# EAGLE design step_down (EAGLE 8.7.0)
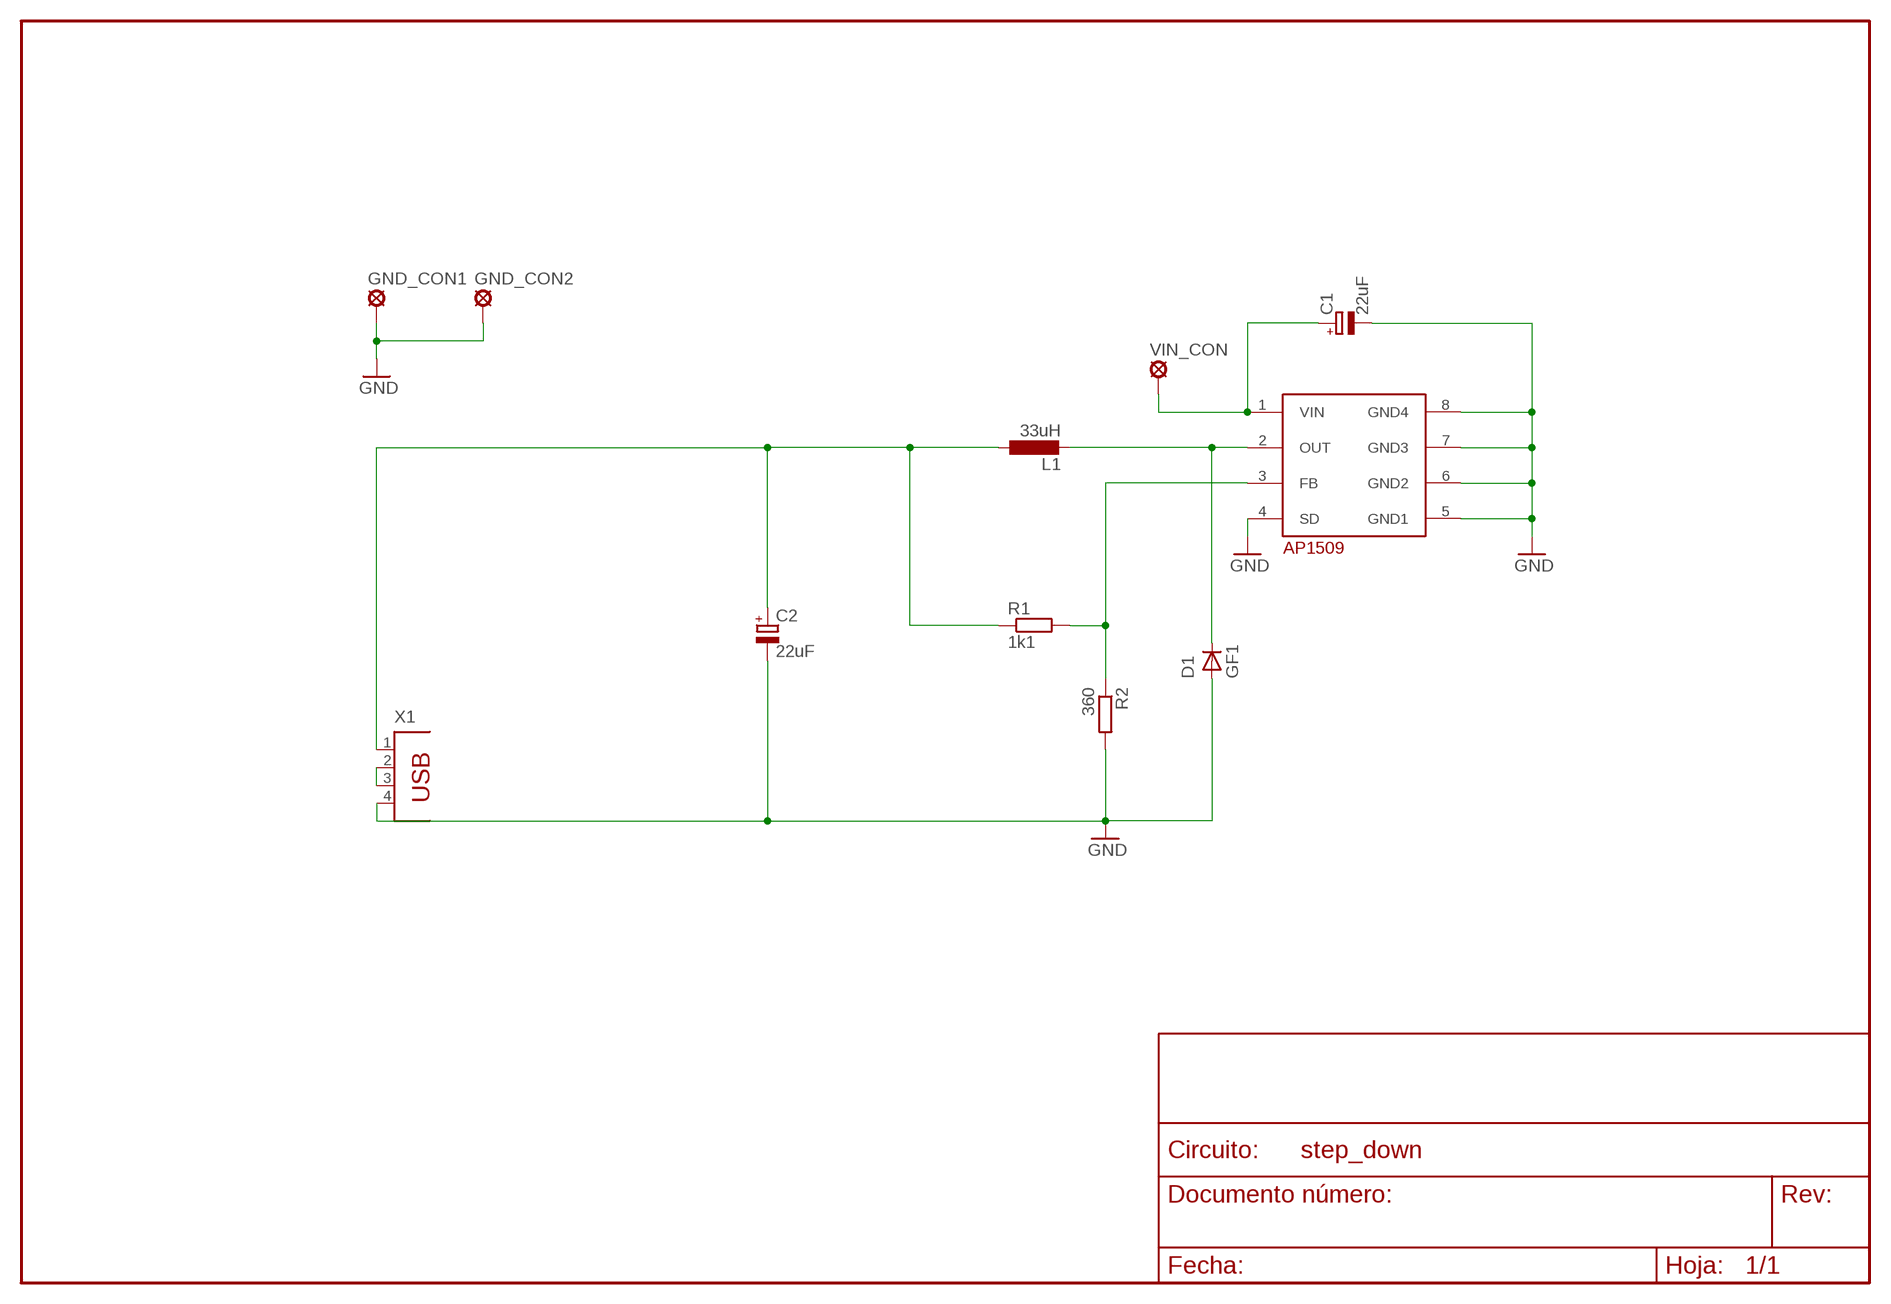
[diagram p0: schematic, sheet 1]

## Parts
C1  22uF  CPOL-EUCT7343  [CT7343]
C2  22uF  CPOL-EUCT3216  [CT3216]
D1  GF1  [SMA-DO214AC]
GND_CON1  SE14  [SE14]
GND_CON2  SE14  [SE14]
L1  33uH  SRN6045TAL  [L8051]
R1  1k1  R-EU_M3216  [M3216]
R2  360  R-EU_M3216  [M3216]
U1  AP1509S  [SOIC8]
VIN_CON  SE14  [SE14]
X1  PN87520  [PN87520]

## Nets
GND: C1.- C2.- D1.A GND_CON1.MP GND_CON2.MP R2.2 U1.4(SD) U1.5(GND1) U1.6(GND2) U1.7(GND3) U1.8(GND4) X1.4
N$1: C1.+ U1.1(VIN) VIN_CON.MP
N$2: X1.2 X1.3
N$3: D1.K(C) L1.2 U1.2(OUT)
N$4: C2.+ L1.1 R1.1 X1.1
N$5: R1.2 R2.1 U1.3(FB)

## Library data of the parts
C1 C2 = rcl:CPOL-EU: POLARIZED CAPACITOR, European symbol; SPICEPREFIX: C
D1 = diode:GF1: DIODE; SPICEPREFIX: D
GND_CON1 GND_CON2 VIN_CON = solpad:SE14: SOLDER PAD E1553, drill 1,4mm, distributor Buerklin, 07F820
L1 = rcl_UCA:SRN6045TA: Bourns Semi-shielded Power Inductors
R1 R2 = rcl:R-EU_: RESISTOR, European symbol; SPICEPREFIX: R
U1 = diodes_inc_UCA:AP1509: PWM buck DC-DC control circuit
X1 = con-berg:PN87520: BERG USB connector; OC_FARNELL: unknown; OC_NEWARK: unknown

## Board
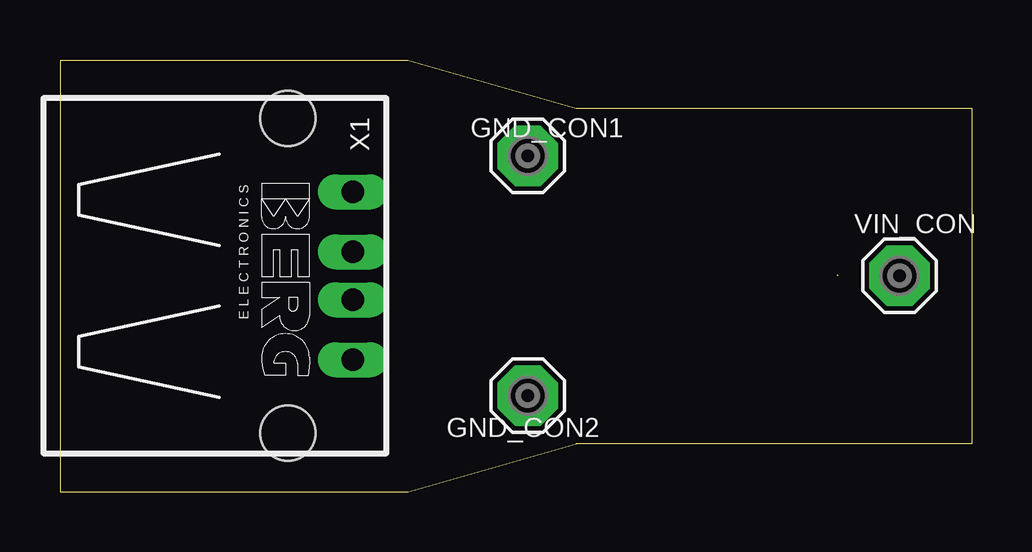
[diagram p1: board, top side]
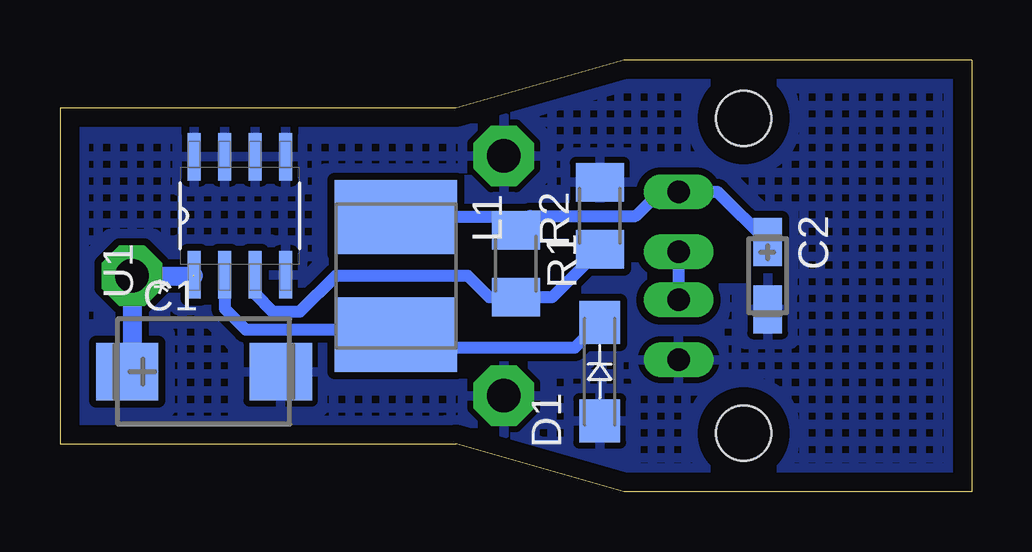
[diagram p2: board, bottom side, seen from below]

Size 38 x 18 mm. Coordinates in mm from the lower left corner, seen from the top.
Outline: 14.5,18 21.5,16 38,16 38,2 21.5,2 14.5,0 0,0 0,18 14.5,18
Copper layers (1*16): Top 0.035mm / dielectric 1.5mm / Bottom 0.035mm
Design rules "default *": minimum track width 10mil, minimum drill 24mil, track to track 8mil, track to pad 12mil, pad to pad 12mil, via to via 8mil, smd to smd 8mil, copper to edge 30mil, drill to drill 8mil, minimum pad ring 10mil, minimum via ring 8mil, stop-mask expansion 4mil, vias tented up to drill 0mil, thermal gap 10mil
bRestrict: area 9.5,9 to 10.5,9.5

### Footprints (pad centres in the part's own frame; a part is rotated, then mirrored left to right if it is on the bottom)
CT7343 = smd 2.6 x 2.4: + -3.2,0; - 3.2,0
CT3216 = smd 2 x 1.2: + -1.4,0; - 1.4,0
SMA-DO214AC = smd 1.8 x 1.7: A -2.05,0; K 2.05,0
SE14 = drill 1.397 pad 2.54 octagon: MP 0,0
L8051 = smd 3.1 x 5.1: 1 -2.45,0; 2 2.45,0
M3216 = smd 1.6 x 2: 1 -1.4,0; 2 1.4,0
SOIC8 = smd 1.981 x 0.559: 1 -2.464,1.905; 2 -2.464,0.635; 3 -2.464,-0.635; 4 -2.464,-1.905; 5 2.464,-1.905; 6 2.464,-0.635; 7 2.464,0.635; 8 2.464,1.905
PN87520 = drill 0.95 long: 1 -3.5,2.71; 2 -1,2.71; 3 1,2.71; 4 3.5,2.71 | hole 2.3: -6.57,0; 6.57,0

### Placement (x,y rotation side)
C1  32,5 0 bottom
C2  8.5,9 270 bottom
D1  15.5,5 90 bottom
GND_CON1  19.5,14 0 top
GND_CON2  19.5,4 0 top
L1  24,9 270 bottom
R1  19,9.5 270 bottom
R2  15.5,11.5 90 bottom
U1  30.5,11.5 90 bottom
U$1  [LOGO6AA_MPEQ_REF]  6,11 0 bottom
VIN_CON  35,9 0 top
X1  9.5,9 270 top

### Tracks (layer width: path | path; a pad name or v marks a point on that pad's centre or on a via)
GND
  Bottom 0.5: 15.26,2.45 D1.A | U1.5 28.56,14
  pour Bottom (isolate 0.3, hatched): 0,18 0,0 14.5,0 21.5,2 38,2 38,16 21.5,16 14.5,18
N$1  (1 unrouted)
  Bottom 0.5: 35,5.2 C1.+
  Bottom 0.8: 32.44,9 VIN_CON.MP 35,5.2
N$2
  Bottom 0.5: X1.2 X1.3
N$3
  Bottom 0.5: D1.K 16.55,6 23.45,6 L1.2 24.2,6.75 30.25,6.75 31.14,7.63 U1.2
N$4
  Bottom 0.5: L1.1 19.55,11.45 R1.1 18.4,11.5 14,11.5 13,12.5 X1.1 10.6,12.5 C2.+
N$5
  Bottom 0.5: R2.1 17.5,8.1 R1.2 20.1,8.1 21,9 26.5,9 28.01,7.49 29.1,7.49 29.86,8.25 U1.3

### Text on the board
Reference: 17-18